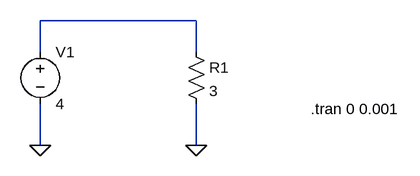
[diagram p0: schematic simple_resistor.asc]
simple_resistor.asc, the LTspice schematic file:
Version 4
SHEET 1 880 680
WIRE 464 96 224 96
WIRE 224 144 224 96
WIRE 464 144 464 96
WIRE 224 288 224 224
WIRE 464 288 464 224
FLAG 224 288 0
FLAG 464 288 0
SYMBOL voltage 224 128 R0
SYMATTR InstName V1
SYMATTR Value 4
SYMBOL res 448 128 R0
SYMATTR InstName R1
SYMATTR Value 3
TEXT 640 232 Left 2 !.tran 0 0.001

The netlist it stands for:
* simple_resistor.asc
V1 N001 0 4
R1 N001 0 3
.tran 0 0.001
.backanno
.end